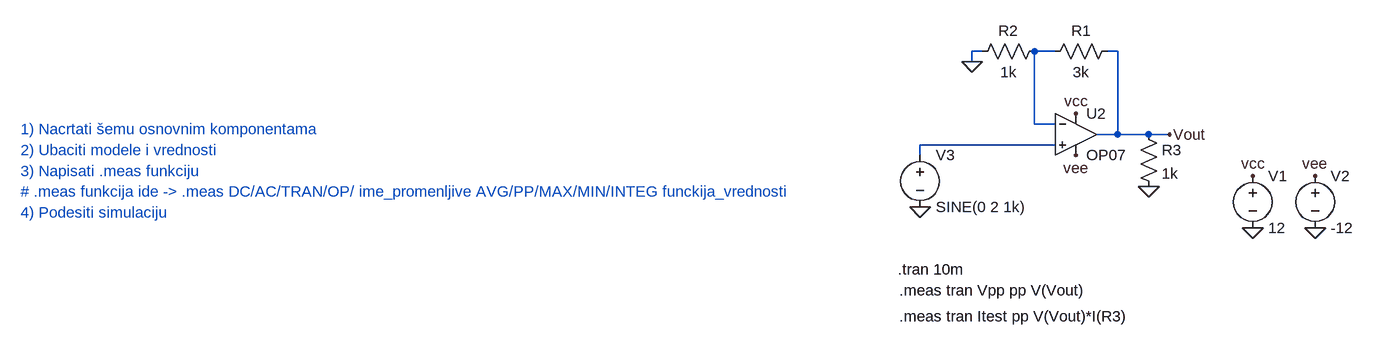
[diagram p0: schematic V7_MEAS.asc]
V7_MEAS.asc, the LTspice schematic file:
Version 4
SHEET 1 880 680
WIRE 160 32 144 32
WIRE 272 32 240 32
WIRE 368 32 352 32
WIRE 144 48 144 32
WIRE 240 144 240 32
WIRE 272 144 240 144
WIRE 368 160 368 32
WIRE 368 160 336 160
WIRE 416 160 368 160
WIRE 448 160 416 160
WIRE 272 176 64 176
WIRE 64 192 64 176
FLAG 576 304 0
FLAG 576 224 vcc
FLAG 672 304 0
FLAG 672 224 vee
FLAG 304 192 vee
FLAG 304 128 vcc
FLAG 64 272 0
FLAG 448 160 Vout
FLAG 416 240 0
FLAG 144 48 0
SYMBOL voltage 576 208 R0
WINDOW 123 0 0 Left 0
WINDOW 39 0 0 Left 0
SYMATTR InstName V1
SYMATTR Value 12
SYMBOL voltage 672 208 R0
WINDOW 123 0 0 Left 0
WINDOW 39 0 0 Left 0
SYMATTR InstName V2
SYMATTR Value -12
SYMBOL voltage 64 176 R0
WINDOW 123 0 0 Left 0
WINDOW 39 0 0 Left 0
SYMATTR InstName V3
SYMATTR Value SINE(0 2 1k)
SYMBOL res 400 144 R0
SYMATTR InstName R3
SYMATTR Value 1k
SYMBOL OpAmps\\OP07 304 96 R0
SYMATTR InstName U2
SYMBOL res 368 16 R90
WINDOW 0 0 56 VBottom 2
WINDOW 3 32 56 VTop 2
SYMATTR InstName R1
SYMATTR Value 3k
SYMBOL res 144 48 R270
WINDOW 0 32 56 VTop 2
WINDOW 3 0 56 VBottom 2
SYMATTR InstName R2
SYMATTR Value 1k
TEXT 30 368 Left 2 !.tran 10m
TEXT 32 400 Left 2 !.meas tran Vpp pp V(Vout)
TEXT 32 440 Left 2 !.meas tran Itest pp V(Vout)*I(R3)
TEXT -1320 152 Left 2 ;1) Nacrtati šemu osnovnim komponentama
TEXT -1320 184 Left 2 ;2) Ubaciti modele i vrednosti
TEXT -1320 216 Left 2 ;3) Napisati .meas funkciju
TEXT -1320 248 Left 2 ;# .meas funkcija ide -> .meas DC/AC/TRAN/OP/ ime_promenljive AVG/PP/MAX/MIN/INTEG funckija_vrednosti
TEXT -1320 280 Left 2 ;4) Podesiti simulaciju

The netlist it stands for:
* V7_MEAS.asc
V1 vcc 0 12
V2 vee 0 -12
V3 N002 0 SINE(0 2 1k)
R3 Vout 0 1k
XU2 N002 N001 vcc vee Vout LT1001  ; OP07, pins In+ In- V+ V- OUT
R1 Vout N001 3k
R2 0 N001 1k
.tran 10m
.meas tran Vpp pp V(Vout)
.meas tran Itest pp V(Vout)*I(R3)
* 1) Nacrtati šemu osnovnim komponentama
* 2) Ubaciti modele i vrednosti
* 3) Napisati .meas funkciju
* # .meas funkcija ide -> .meas DC/AC/TRAN/OP/ ime_promenljive AVG/PP/MAX/MIN/INTEG funckija_vrednosti
* 4) Podesiti simulaciju
.lib LTC.lib
.backanno
.end